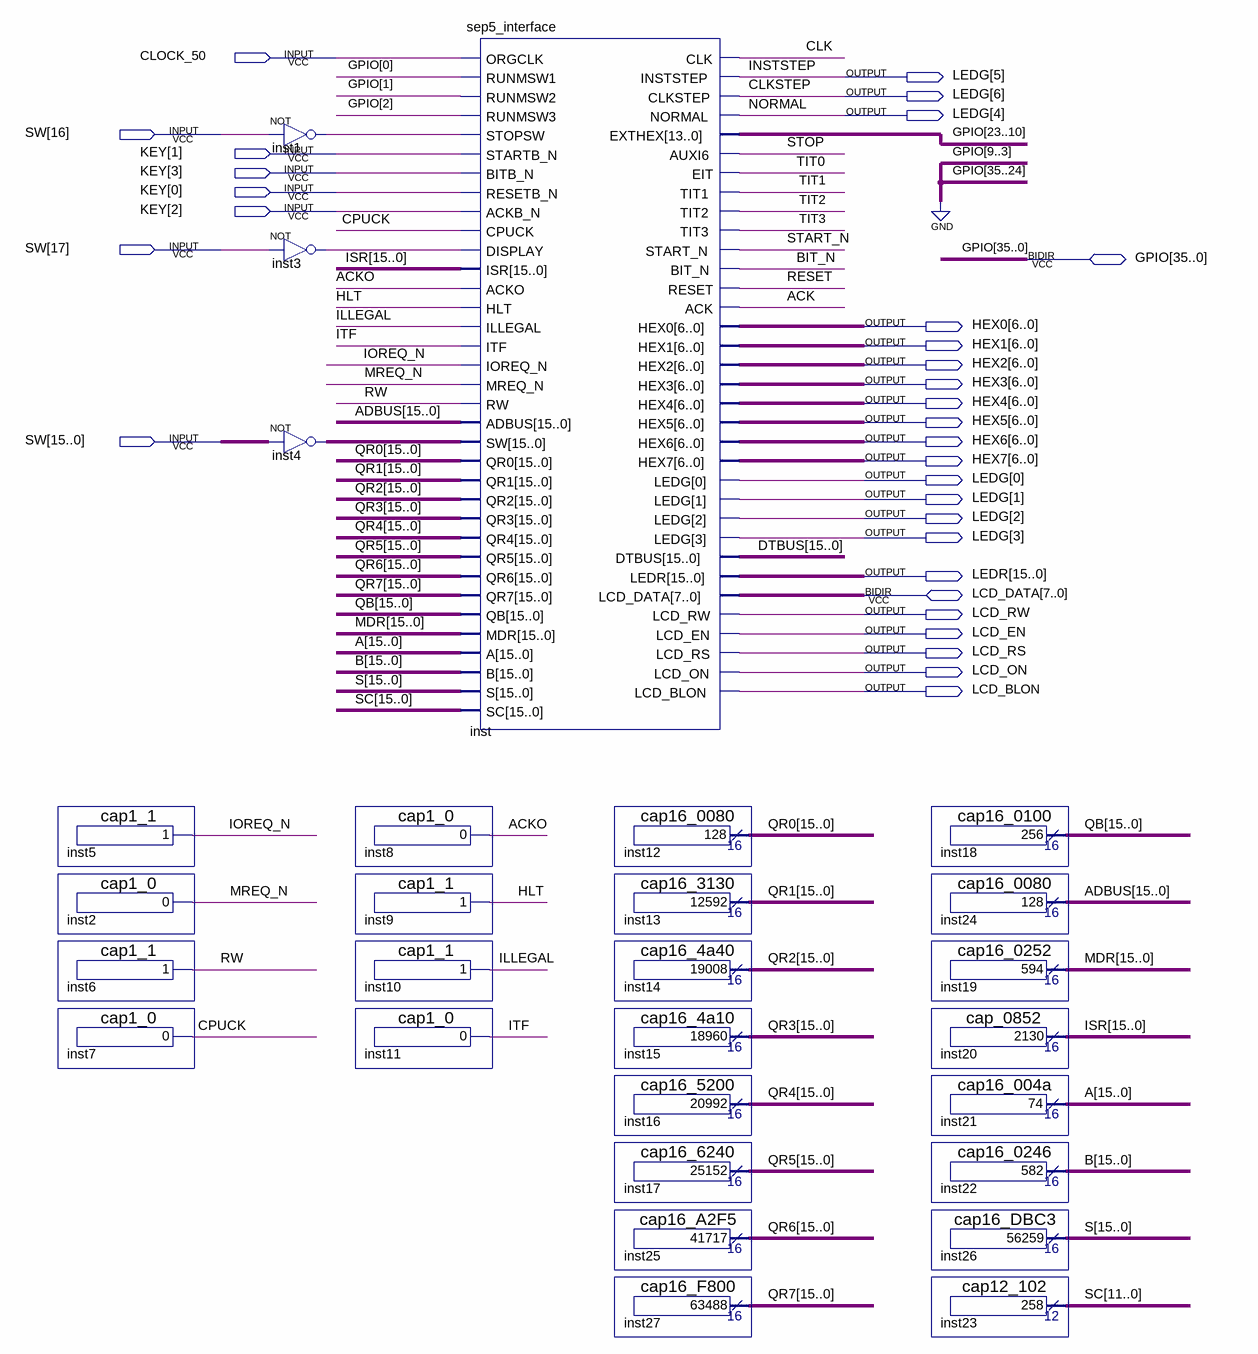
[diagram p0: schematic sheet]
// Quartus schematic reg16_pc_interface.bdf as structural Verilog: 28 symbols, 31 pins
module reg16_pc_interface (
  input  CLOCK_50,
  input  [17:0] SW,
  input  [3:0] KEY,
  inout  [35:0] GPIO,
  inout  [7:0] LCD_DATA,
  output [6:0] LEDG,
  output [6:0] HEX0,
  output [6:0] HEX1,
  output [6:0] HEX2,
  output [6:0] HEX3,
  output [6:0] HEX4,
  output [6:0] HEX5,
  output [6:0] HEX6,
  output [6:0] HEX7,
  output [15:0] LEDR,
  output LCD_RW,
  output LCD_EN,
  output LCD_RS,
  output LCD_ON,
  output LCD_BLON
);

  wire ACK, ACKO, BIT_N, CLK, CPUCK, HLT, ILLEGAL, inst1_out, inst3_out, IOREQ_N, ITF, MREQ_N, RESET, RW,
       START_N, STOP, TIT0, TIT1, TIT2, TIT3;
  wire [15:0] A, ADBUS, B, DTBUS, inst4_out, ISR, MDR, QB, QR0, QR1, QR2, QR3, QR4, QR5, QR6, QR7, S, SC;

  cap1_1 inst5 (.result(IOREQ_N));
  cap1_0 inst2 (.result(MREQ_N));
  cap1_1 inst6 (.result(RW));
  cap1_0 inst7 (.result(CPUCK));
  not inst1 (inst1_out, SW[16]);
  not inst3 (inst3_out, SW[17]);
  assign inst4_out = ~SW[15:0];  // NOT inst4, 16 bits wide
  cap1_0 inst8 (.result(ACKO));
  cap1_1 inst9 (.result(HLT));
  cap1_1 inst10 (.result(ILLEGAL));
  cap1_0 inst11 (.result(ITF));
  sep5_interface inst (
    .ORGCLK(CLOCK_50), .RUNMSW1(GPIO[0]), .RUNMSW2(GPIO[1]), .RUNMSW3(GPIO[2]), .STOPSW(inst1_out),
    .STARTB_N(KEY[1]), .BITB_N(KEY[3]), .RESETB_N(KEY[0]), .ACKB_N(KEY[2]), .CPUCK(CPUCK),
    .DISPLAY(inst3_out), .ISR(ISR), .ACKO(ACKO), .HLT(HLT), .ILLEGAL(ILLEGAL), .ITF(ITF), .IOREQ_N(IOREQ_N),
    .MREQ_N(MREQ_N), .RW(RW), .ADBUS(ADBUS), .SW(inst4_out), .QR0(QR0), .QR1(QR1), .QR2(QR2), .QR3(QR3),
    .QR4(QR4), .QR5(QR5), .QR6(QR6), .QR7(QR7), .QB(QB), .MDR(MDR), .A(A), .B(B), .S(S), .SC(SC), .CLK(CLK),
    .INSTSTEP(LEDG[5]), .CLKSTEP(LEDG[6]), .NORMAL(LEDG[4]), .EXTHEX(GPIO[23:10]), .AUXI6(STOP), .EIT(TIT0),
    .TIT1(TIT1), .TIT2(TIT2), .TIT3(TIT3), .START_N(START_N), .BIT_N(BIT_N), .RESET(RESET), .ACK(ACK),
    .HEX0(HEX0), .HEX1(HEX1), .HEX2(HEX2), .HEX3(HEX3), .HEX4(HEX4), .HEX5(HEX5), .HEX6(HEX6), .HEX7(HEX7),
    .LEDG(LEDG[3:0]), .LEDR(LEDR), .LCD_DATA(LCD_DATA), .LCD_RW(LCD_RW), .LCD_EN(LCD_EN), .LCD_RS(LCD_RS),
    .LCD_ON(LCD_ON), .LCD_BLON(LCD_BLON), .DTBUS(DTBUS));
  cap16_0080 inst12 (.result(QR0));
  cap16_3130 inst13 (.result(QR1));
  cap16_4a40 inst14 (.result(QR2));
  cap16_4a10 inst15 (.result(QR3));
  cap16_5200 inst16 (.result(QR4));
  cap16_6240 inst17 (.result(QR5));
  cap16_A2F5 inst25 (.result(QR6));
  cap16_F800 inst27 (.result(QR7));
  cap16_0100 inst18 (.result(QB));
  cap16_0080 inst24 (.result(ADBUS));
  cap16_0252 inst19 (.result(MDR));
  cap_0852 inst20 (.result(ISR));
  cap16_004a inst21 (.result(A));
  cap16_0246 inst22 (.result(B));
  cap16_DBC3 inst26 (.result(S));
  cap12_102 inst23 (.result(SC[11:0]));
  // also tied to GND on the sheet: {GPIO[3], GPIO[4], GPIO[5], GPIO[6], GPIO[7], GPIO[8], GPIO[9], GPIO[24], GPIO[25], GPIO[26], GPIO[27], GPIO[28], GPIO[29], GPIO[30], GPIO[31], GPIO[32], GPIO[33], GPIO[34], GPIO[35]}

  // Other names for the same wires on the sheet: CLKSTEP = LEDG[6]; INSTSTEP = LEDG[5]; NORMAL = LEDG[4]
endmodule
